# EasyEDA Pro project v02_g.eprj

# Schematic Schematic1
Create Date: 2023-01-16; Page Name: P1; Project Name: v02_g; Schematic Name: Schematic1; Update Date: 2024-06-27; Company: KC3LBR; Drawed: EasyEDA Pro; Page Size: A3; Part Number: JLCPCB-001; Reviewed: EasyEDA Pro; Version: 2023.09.11
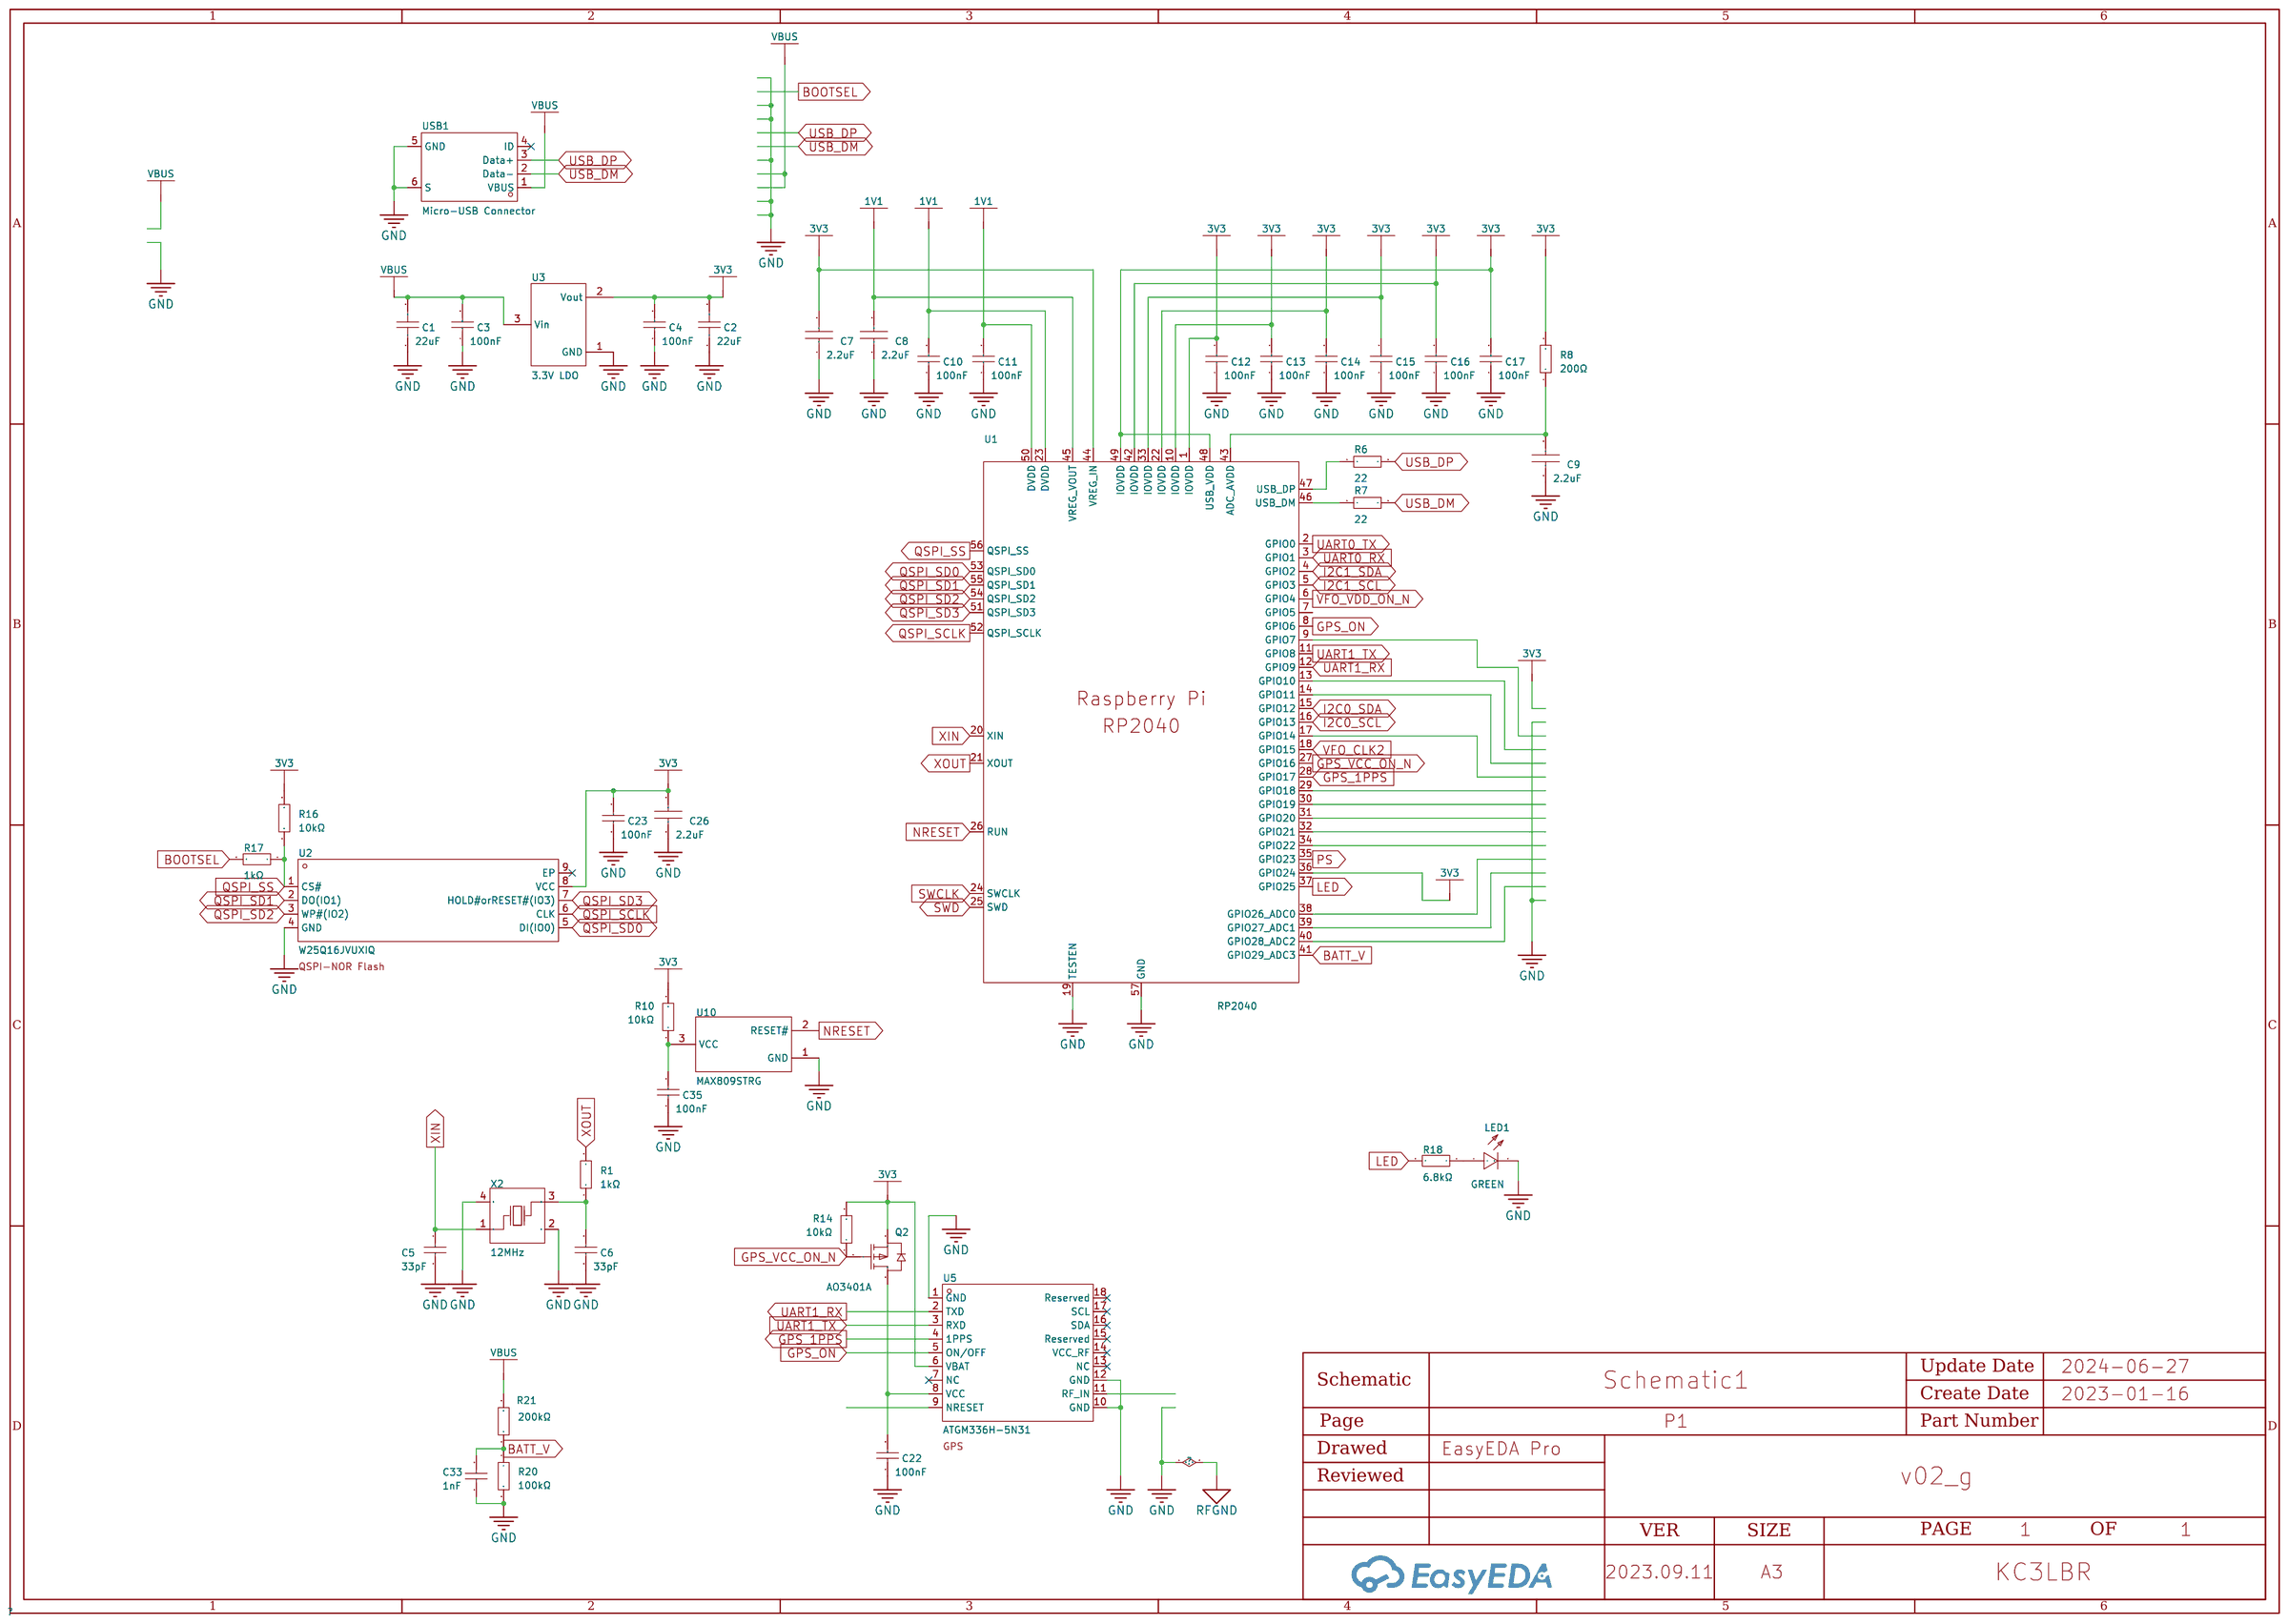
[diagram p0: schematic sheet]

## Parts
C1  22uF  [C0805]
C2  22uF  [C0603]
C3  100nF  [C0402_NEW]
C4  100nF  [C0402_NEW]
C5  33pF  [C0402]
C6  33pF  [C0402]
C7  2.2uF  [C0402]
C8  2.2uF  [C0402]
C9  2.2uF  [C0402]
C10  100nF  [C0402_NEW]
C11  100nF  [C0402_NEW]
C12  100nF  [C0402_NEW]
C13  100nF  [C0402_NEW]
C14  100nF  [C0402_NEW]
C15  100nF  [C0402_NEW]
C16  100nF  [C0402_NEW]
C17  100nF  [C0402_NEW]
C22  100nF  [C0402_NEW]
C23  100nF  [C0402_NEW]
C26  2.2uF  [C0402]
C33  1nF  [C0402]
C35  100nF  [C0402_NEW]
LED1  GREEN  [LED0603-R-RD]
Q2  AO3401A  [SOT-23_L2.9-W1.3-P1.90-LS2.4-BR]
R1  1kΩ  [R0402]
R6  22  [R0402]
R7  22  [R0402]
R8  200Ω  [R0402]
R10  10kΩ  [R0402]
R14  10kΩ  [R0402]
R16  10kΩ  [R0402]
R17  1kΩ  [R0402]
R18  6.8kΩ  [R0402]
R20  100kΩ  [R0402]
R21  200kΩ  [R0402]
U1  RP2040  [LQFN-56_L7.0-W7.0-P0.4-EP]
U2  W25Q16JVUXIQ  [USON-8_L3.0-W2.0-P0.50-BL-EP]
U3  3.3V LDO  [SOT-23-3_L2.9-W1.6-P1.90-LS2.8-BR]
U5  ATGM336H-5N31  [GPSM-SMD_ATGM336H-TR]
U10  MAX809STRG  [SOT-23-3_L2.9-W1.6-P1.90-LS2.8-BR]
USB1  Micro-USB Connector  [MICRO-USB-SMD_10118194-0001LF]
X2  12MHz  [OSC-SMD_4P-L3.2-W2.5-BL]

## Library data of the parts
C1 = CL21A226MAQNNNE_C45783: Capacitance: Tolerance:±20% Tolerance:±20% Voltage Rated: Temperature Coefficient:; LCSC Part Name: 22uF ±20% 25V; Supplier Part: C45783; Manufacturer: SAMSUNG(三星); Manufacturer Part: CL21A226MAQNNNE; Supplier Footprint: 0805; JLCPCB Part Class: Basic Part; Datasheet: https://atta.szlcsc.com/upload/public/pdf/source/20160103/1457707727161.pdf; Supplier: LCSC; Tolerance: ±20%
C2 = CL10A226MQ8NRNC: Capacitance: Tolerance:±20% Tolerance:±20% Voltage Rated: Temperature Coefficient:; LCSC Part Name: 22uF ±20% 6.3V; Supplier Part: C59461; Manufacturer: SAMSUNG(三星); Supplier Footprint: 0603; JLCPCB Part Class: Basic Part; Datasheet: https://atta.szlcsc.com/upload/public/pdf/source/20160103/1457707740762.pdf; Supplier: LCSC; Tolerance: ±20%
C3 C4 C10-C17 C22 C23 C35 = CL05B104KO5NNNC: Capacitance: Tolerance:±10% Tolerance:±10% Voltage Rated: Temperature Coefficient:; LCSC Part Name: 100nF ±10% 16V; Supplier Part: C1525; Manufacturer: SAMSUNG(三星); Supplier Footprint: 0402; JLCPCB Part Class: Basic Part; Datasheet: https://atta.szlcsc.com/upload/public/pdf/source/20160103/1457707674891.pdf; Supplier: LCSC; Tolerance: ±10%
C5 C6 = 0402CG330J500NT: Capacitance: Tolerance:±5% Tolerance:±5% Voltage Rated: Temperature Coefficient:; LCSC Part Name: 33pF ±5% 50V; Supplier Part: C1562; Manufacturer: FH(风华); Supplier Footprint: 0402; JLCPCB Part Class: Basic Part; Datasheet: https://atta.szlcsc.com/upload/public/pdf/source/20170923/C1562_1506149272462988369.pdf; Supplier: LCSC; Tolerance: ±5%
C7-C9 C26 = CL05A225MQ5NSNC: Capacitance: Tolerance:±20% Tolerance:±20% Voltage Rated: Temperature Coefficient:; LCSC Part Name: 2.2uF ±20% 6.3V; Supplier Part: C12530; Manufacturer: SAMSUNG(三星); Supplier Footprint: 0402; JLCPCB Part Class: Basic Part; Datasheet: https://atta.szlcsc.com/upload/public/pdf/source/20160103/1457707666860.pdf; Supplier: LCSC; Tolerance: ±20%
C33 = 0402B102K500NT: Capacitance: Tolerance:±10% Tolerance:±10% Voltage Rated: Temperature Coefficient:; LCSC Part Name: 1nF ±10% 50V; Supplier Part: C1523; Manufacturer: FH(风华); Supplier Footprint: 0402; JLCPCB Part Class: Basic Part; Datasheet: https://atta.szlcsc.com/upload/public/pdf/source/20170923/C1523_1506149254821988331.pdf; Supplier: LCSC; Tolerance: ±10%
LED1 = 19-217/GHC-YR1S2/3T: Emitted Color:Emerald Diode Configuration:- Lens Color:Colorless transparence Dominant Wavelength:520nm~535nm Dominant Wavelength:520nm~535nm Peak Wavelength:518nm Color Temperature:- Color Temperature:- Forward Current:20mA Power Dissipation:110mW Viewin; LCSC Part Name: 翠绿 520nm~535nm; Supplier Part: C72043; Manufacturer: EVERLIGHT(亿光); Supplier Footprint: 0603; JLCPCB Part Class: Basic Part; Datasheet: https://atta.szlcsc.com/upload/public/pdf/source/20160507/1462613613780.pdf; Supplier: LCSC; Emitted Color: Emerald; Lens Color: Colorless transparence; Dominant Wavelength: 520nm~535nm; Peak Wavelength: 518nm; Forward Current: 20mA; Power Dissipation: 110mW; Viewing Angle: 120°; Operating Temperature: -40~+85
Q2 = AO3401A_C15127: Type: Drain Source Voltage (Vdss): Continuous Drain Current (Id): Power Dissipation (Pd): Drain Source On Resistance (RDS(on)@Vgs,Id):44mΩ@10V,4.3A Gate Threshold Voltage (Vgs(th)@Id):1.3V@250uA; LCSC Part Name: P沟道 30V 4A; Supplier Part: C15127; Manufacturer: AOS; Supplier Footprint: SOT-23; JLCPCB Part Class: Basic Part; Datasheet: https://atta.szlcsc.com/upload/public/pdf/source/20160507/1462613609053.pdf; Supplier: LCSC; Drain Source On Resistance (RDS(on)@Vgs,Id): 44mΩ@10V,4.3A; Gate Threshold Voltage (Vgs(th)@Id): 1.3V@250uA
R1 R17 = 0402WGF1001TCE: Type:Thick Film Resistors Resistance: Tolerance:±1% Tolerance:±1% Power(Watts): Temperature Coefficient:±100ppm/ Temperature Coefficient:±100ppm/ Overload Voltage (Max): Operating Temperature Range:-55~+155 Operating Temperature Range:-55~+155; LCSC Part Name: 1kΩ ±1% 62.5mW; Supplier Part: C11702; Manufacturer: UNI-ROYAL(厚声); Supplier Footprint: 0402; JLCPCB Part Class: Basic Part; Datasheet: https://atta.szlcsc.com/upload/public/pdf/source/20200306/C422600_1E6D84923E4A46A82E41ADD87F860B5C.pdf; Supplier: LCSC; Type: Thick Film Resistors; Tolerance: ±1%; Temperature Coefficient: ±100ppm/; Operating Temperature Range: -55~+155
R6 R7 = 0402WGF220JTCE: LCSC Part Name: 22Ω(22R0) ±1% 编带; Supplier Part: C25092; Manufacturer: UNI-ROYAL(厚声); Supplier Footprint: 0402; JLCPCB Part Class: Basic Part; Datasheet: https://atta.szlcsc.com/upload/public/pdf/source/20170920/C25092_1505901206069982723.pdf; Supplier: LCSC
R8 = 0402WGF2000TCE: Type:Thick Film Resistors Resistance: Tolerance:±1% Tolerance:±1% Power(Watts): Temperature Coefficient:±100ppm/ Temperature Coefficient:±100ppm/ Overload Voltage (Max): Operating Temperature Range:-55~+155 Operating Temperature Range:-55~+155; LCSC Part Name: 200Ω ±1% 62.5mW; Supplier Part: C25087; Manufacturer: UNI-ROYAL(厚声); Supplier Footprint: 0402; JLCPCB Part Class: Basic Part; Datasheet: https://atta.szlcsc.com/upload/public/pdf/source/20200306/C422600_1E6D84923E4A46A82E41ADD87F860B5C.pdf; Supplier: LCSC; Type: Thick Film Resistors; Tolerance: ±1%; Temperature Coefficient: ±100ppm/; Operating Temperature Range: -55~+155
R10 R14 R16 = 0402WGF1002TCE: Type:Thick Film Resistors Resistance: Tolerance:±1% Tolerance:±1% Power(Watts): Temperature Coefficient:±100ppm/ Temperature Coefficient:±100ppm/ Overload Voltage (Max): Operating Temperature Range:-55~+155 Operating Temperature Range:-55~+155; LCSC Part Name: 10kΩ ±1% 62.5mW; Supplier Part: C25744; Manufacturer: UNI-ROYAL(厚声); Supplier Footprint: 0402; JLCPCB Part Class: Basic Part; Datasheet: https://atta.szlcsc.com/upload/public/pdf/source/20200306/C422600_1E6D84923E4A46A82E41ADD87F860B5C.pdf; Supplier: LCSC; Type: Thick Film Resistors; Tolerance: ±1%; Temperature Coefficient: ±100ppm/; Operating Temperature Range: -55~+155
R18 = 0402WGF6801TCE: Type:Thick Film Resistors Resistance: Tolerance:±1% Tolerance:±1% Power(Watts): Temperature Coefficient:±100ppm/ Temperature Coefficient:±100ppm/ Overload Voltage (Max): Operating Temperature Range:-55~+155 Operating Temperature Range:-55~+155; LCSC Part Name: 6.8kΩ ±1% 62.5mW; Supplier Part: C25917; Manufacturer: UNI-ROYAL(厚声); Supplier Footprint: 0402; JLCPCB Part Class: Basic Part; Datasheet: https://atta.szlcsc.com/upload/public/pdf/source/20200306/C422600_1E6D84923E4A46A82E41ADD87F860B5C.pdf; Supplier: LCSC; Type: Thick Film Resistors; Tolerance: ±1%; Temperature Coefficient: ±100ppm/; Operating Temperature Range: -55~+155
R20 = 0402WGF1003TCE: Type:Thick Film Resistors Resistance: Tolerance:±1% Tolerance:±1% Power(Watts): Temperature Coefficient:±100ppm/ Temperature Coefficient:±100ppm/ Overload Voltage (Max): Operating Temperature Range:-55~+155 Operating Temperature Range:-55~+155; LCSC Part Name: 100kΩ ±1% 62.5mW; Supplier Part: C25741; Manufacturer: UNI-ROYAL(厚声); Supplier Footprint: 0402; JLCPCB Part Class: Basic Part; Datasheet: https://atta.szlcsc.com/upload/public/pdf/source/20200306/C422600_1E6D84923E4A46A82E41ADD87F860B5C.pdf; Supplier: LCSC; Type: Thick Film Resistors; Tolerance: ±1%; Temperature Coefficient: ±100ppm/; Operating Temperature Range: -55~+155
R21 = 0402WGF2003TCE: Resistance: Tolerance: Power(Watts): Temperature Coefficient: Temperature Coefficient: Overload Voltage (Max): Operating Temperature Range: Operating Temperature Range:; LCSC Part Name: 200KΩ ±1%; Supplier Part: C25764; Manufacturer: UNI-ROYAL(厚声); Supplier Footprint: 0402; JLCPCB Part Class: Basic Part; Datasheet: https://atta.szlcsc.com/upload/public/pdf/source/20170920/C25764_1505901532268983339.pdf; Supplier: LCSC
U1 = RP2040_C2040: CPU Core:ARM Cortex-M0 Maximum Frequency:133MHz Supply Voltage Range:- Supply Voltage Range:- Internal Oscillator:- External Clock Frequency Rang:- External Clock Frequency Rang:- Program FLASH Size:- RAM Size:264KB EEPROM/Data FLASH Size:- GPIO Ports Num; LCSC Part Name: ARM Cortex-M0 133MHz RAM：264KB; Supplier Part: C2040; Manufacturer: Raspberry Pi(树莓派); Supplier Footprint: LQFN-56(7x7); JLCPCB Part Class: Extended Part; Datasheet: https://atta.szlcsc.com/upload/public/pdf/source/20210621/C2040_96F425825606B7957D87DD32E2512CA9.pdf; Supplier: LCSC; CPU Core: ARM Cortex-M0; Maximum Frequency: 133MHz; RAM Size: 264KB; GPIO Ports Number: 30; ADC (Units/Channels/bits): 1@x4ch/12bit; U(S)ART Number: 2; I2C Number: 2; (Q)SPI Number: 2; USB (H/D/OTG): USB Host/Device; Peripherals / Functions / Protocol Stacks: DMA；PWM
U2 = W25Q16JVUXIQ: QSPI-NOR Flash; Supplier Part: C2843335; Manufacturer: WINBOND(华邦); Supplier Footprint: USON-8; JLCPCB Part Class: Extended Part; Datasheet: https://atta.szlcsc.com/upload/public/pdf/source/20210629/C2843335_FB4D78B5076715625DC0C83F790D3044.pdf; Supplier: LCSC
U3 = XC6206P332MR_C5446: Output Type: Output Polarity:Positive Number of Outputs:1 Maximum Input Voltage:6V Output Voltage:3.3V~3.3V Output Voltage:3.3V~3.3V Dropout Voltage:680mV@(100mA) Output Current:200mA Power Supply Rejection Ratio (PSRR):-; LCSC Part Name: 正 Vin=6V Vout=3.3V 200mA; Supplier Part: C5446; Manufacturer: TOREX(特瑞仕); Manufacturer Part: XC6206P332MR; Supplier Footprint: SOT-23; JLCPCB Part Class: Basic Part; Datasheet: https://atta.szlcsc.com/upload/public/pdf/source/20130801/1457706628791.pdf; Supplier: LCSC; Output Polarity: Positive; Number of Outputs: 1; Maximum Input Voltage: 6V; Output Voltage: 3.3V~3.3V; Dropout Voltage: 680mV@(100mA); Output Current: 200mA
U5 = ATGM336H-5N31: GPS; Supplier Part: C90770; Manufacturer: 杭州中科微; Supplier Footprint: 9.7x10.1mm; JLCPCB Part Class: Extended Part; Datasheet: https://atta.szlcsc.com/upload/public/pdf/source/20161226/1482720799860.pdf; Supplier: LCSC
U10 = MAX809STRG: Output Type:推挽 Reset Active Level:低电平有效 Number of Voltages Monitored:1 Threshold Voltage:2.93V Reset Timeout:140ms Operating Temperature:-40~+105@(TJ) Operating Temperature:-40~+105@(TJ) Type of the Power Management Chip:Simple reset/Power-on reset; LCSC Part Name: Voltage Supervisor, Very Low Supply Current, 3-Pin Microprocessor, Reset Monitor; Supplier Part: C9965; Manufacturer: onsemi(安森美); Supplier Footprint: SOT-23; JLCPCB Part Class: Extended Part; Datasheet: https://atta.szlcsc.com/upload/public/pdf/source/20170918/C9965_1505727085373976535.PDF; Supplier: LCSC; Output Type: 推挽; Reset Active Level: 低电平有效; Number of Voltages Monitored: 1; Threshold Voltage: 2.93V; Reset Timeout: 140ms; Operating Temperature: -40~+105@(TJ); Type of the Power Management Chip: Simple reset/Power-on reset
USB1 = 10118194-0001LF: Connector Type:Micro-B Standard:USB 2.0 Gender:Female Number of Contacts:5 Number of Ports:1; LCSC Part Name: Micro-B 母座; Supplier Part: C132563; Manufacturer: Amphenol; Supplier Footprint: SMD; JLCPCB Part Class: Extended Part; Datasheet: https://atta.szlcsc.com/upload/public/pdf/source/20210630/C132563_323781699BE9D7BFAD8DF70EA5820798.pdf; Supplier: LCSC; Connector Type: Micro-B; Standard: USB 2.0; Gender: Female; Number of Contacts: 5; Number of Ports: 1
X2 = X322512MSB4SI: Crystal Type:SMD Crystal Resonator Frequency: Frequency Tolerance:±10ppm Frequency Tolerance:±10ppm Frequency Stability:±30ppm Frequency Stability:±30ppm Load Capacitance: Operating Temperature: Operating Temperature:; LCSC Part Name: 12MHz ±10ppm 20pF; Supplier Part: C9002; Manufacturer: YXC(扬兴晶振); Supplier Footprint: SMD3225-4P; JLCPCB Part Class: Basic Part; Datasheet: https://atta.szlcsc.com/upload/public/pdf/source/20210329/C112971_1F611BDC486E193C1706F6D8EB5AA189.pdf; Supplier: LCSC; Crystal Type: SMD Crystal Resonator; Frequency Tolerance: ±10ppm; Frequency Stability: ±30ppm

## Nets
1V1: C8.2 C10.2 C11.2 U1.23(DVDD) U1.45(VREG_VOUT) U1.50(DVDD)
3V3: C2.2 C4.2 C7.2 C12.2 C13.2 C14.2 C15.2 C16.2 C17.2 C23.2 C26.2 Q2.2(S) R8.2 R10.2 R14.2 R16.2 U1.1(IOVDD) U1.10(IOVDD) U1.22(IOVDD) U1.33(IOVDD) U1.36(GPIO24) U1.42(IOVDD) U1.44(VREG_IN) U1.48(USB_VDD) U1.49(IOVDD) U2.8(VCC) U3.2(Vout) U5.6(VBAT)
GND: C1.1 C2.1 C3.1 C4.1 C5.1 C6.1 C7.1 C8.1 C9.1 C10.1 C11.1 C12.1 C13.1 C14.1 C15.1 C16.1 C17.1 C22.1 C23.1 C26.1 C33.1 C35.1 LED1.2(C) R20.2 U1.19(TESTEN) U1.57(GND) U2.4(GND) U3.1(GND) U5.1(GND) U5.10(GND) U5.12(GND) U10.1(GND) USB1.5(GND) USB1.6(S) X2.2(GND) X2.4(GND)
VBUS: C1.2 C3.2 R21.2 U3.3(Vin) USB1.1(VBUS)
ADC0: U1.38(GPIO26_ADC0)
ADC1: U1.39(GPIO27_ADC1)
ADC2: U1.40(GPIO28_ADC2)
ADC_AVDD: C9.2 R8.1 U1.43(ADC_AVDD)
BATT_V: C33.2 R20.1 R21.1 U1.41(GPIO29_ADC3)
BOOTSEL: R17.2
GPIO7: U1.9(GPIO7)
GPIO10: U1.13(GPIO10)
GPIO11: U1.14(GPIO11)
GPIO14: U1.17(GPIO14)
GPIO18: U1.29(GPIO18)
GPIO19: U1.30(GPIO19)
GPIO20: U1.31(GPIO20)
GPIO21: U1.32(GPIO21)
GPIO22: U1.34(GPIO22)
GPS_1PPS: U1.28(GPIO17) U5.4(1PPS)
GPS_3V3: C22.2 Q2.3(D) U5.8(VCC)
GPS_ANT: U5.11(RF_IN)
GPS_ON: U1.8(GPIO6) U5.5(ON/OFF)
GPS_VCC_ON_N: Q2.1(G) R14.1 U1.27(GPIO16)
I2C0_SCL: U1.16(GPIO13)
I2C0_SDA: U1.15(GPIO12)
I2C1_SCL: U1.5(GPIO3)
I2C1_SDA: U1.4(GPIO2)
LED: R18.2 U1.37(GPIO25)
NRESET: U1.26(RUN) U10.2(RESET#)
PS: U1.35(GPIO23)
QSPI_SCLK: U1.52(QSPI_SCLK) U2.6(CLK)
QSPI_SD0: U1.53(QSPI_SD0) U2.5(DI(IO0))
QSPI_SD1: U1.55(QSPI_SD1) U2.2(DO(IO1))
QSPI_SD2: U1.54(QSPI_SD2) U2.3(WP#(IO2))
QSPI_SD3: U1.51(QSPI_SD3) U2.7(HOLD#orRESET#(IO3))
QSPI_SS: R16.1 R17.1 U1.56(QSPI_SS) U2.1(CS#)
SWCLK: U1.24(SWCLK)
SWD: U1.25(SWD)
UART0_RX: U1.3(GPIO1)
UART0_TX: U1.2(GPIO0)
UART1_RX: U1.12(GPIO9) U5.2(TXD)
UART1_TX: U1.11(GPIO8) U5.3(RXD)
USB_DM: R7.2 USB1.2(Data-)
USB_DP: R6.2 USB1.3(Data+)
VFO_CLK2: U1.18(GPIO15)
VFO_VDD_ON_N: U1.6(GPIO4)
XIN: C5.2 U1.20(XIN) X2.1(OSC1)
XOUT: R1.2 U1.21(XOUT)
$1N22007: R7.1 U1.46(USB_DM)
$1N22362: R6.1 U1.47(USB_DP)
$1N70752: C6.2 R1.1 X2.3(OSC2)
$1N107124: LED1.1(A) R18.1
$1N115739: C35.2 R10.1 U10.3(VCC)

Not connected (* = marked no-connect by the designer): U1 7(GPIO5); U2 9(EP)*; U5 7(NC)* 9(NRESET) 13(NC)* 14(VCC_RF)* 15(Reserved)* 16(SDA)* 17(SCL)* 18(Reserved)*; USB1 4(ID)*

# Board PCB1
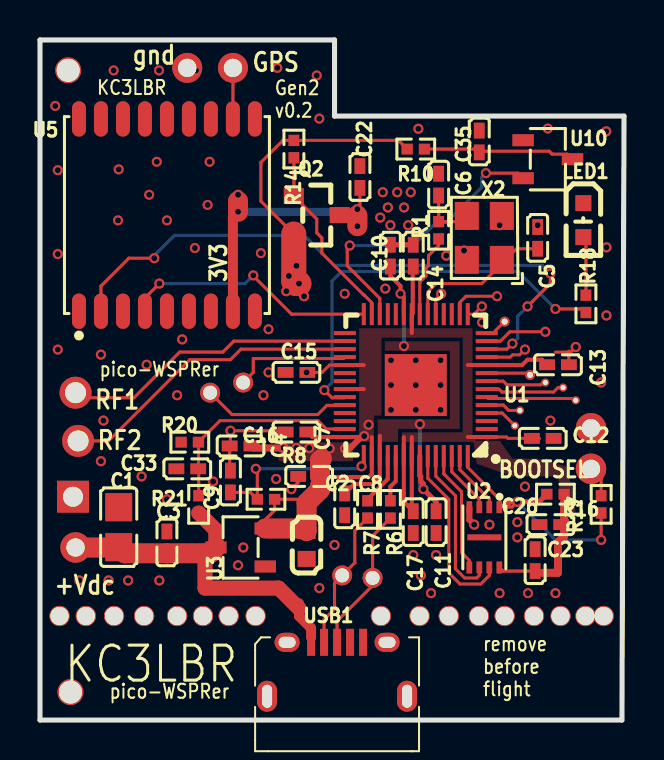
[diagram p1: board, top side]
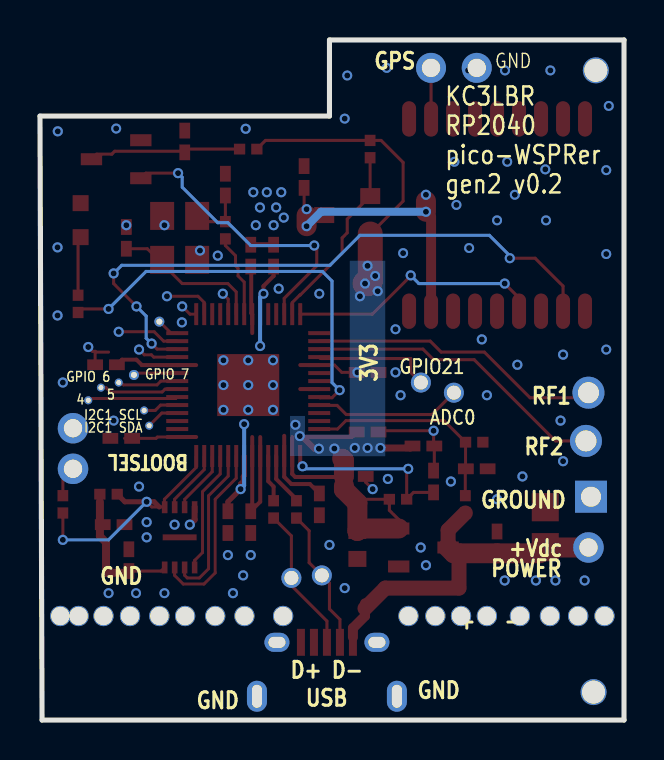
[diagram p2: board, bottom side, seen from below]

Outline 29.21 x 34.04 mm; copper layers: Top Layer, Bottom Layer. Coordinates in mm from the lower left corner of the outline.
Outline path: 0,34.04 0,0 29.11,0 29.21,30.23 14.73,30.23 14.73,34.04 0,34.04
Stack: Top Layer 0.035mm / Dielectric1 1.51mm FR4 er 4.5 / Bottom Layer 0.035mm

## Design rules (mm)
spacing safeClearance (default): track to track 0.152, other pairs 0.152 to 0.3
track width trackWidth (default): min 0.127, default 0.254, max 2.54
differential pair differentialPair (default): width min 0.127, default 0.254, max 2.54; gap min 0.152, default 0.152
via viaSize (default): diameter min 0.5, default 0.61, max 10; hole min 0.3, default 0.305, max 6

## Placement (name value [footprint] x y rotation side)
C1  22uF  [C0805]  3.94 9.65 270 top
C2  22uF  [C0603]  13.34 8.76 90 top
C3  100nF  [C0402_NEW]  6.35 8.89 270 top
C4  100nF  [C0402_NEW]  10.03 13.72 0 top
C5  33pF  [C0402]  24.89 24.13 270 top
C6  33pF  [C0402]  19.94 26.8 270 top
C7  2.2uF  [C0402]  13.46 12.19 0 top
C8  2.2uF  [C0402]  15.24 10.79 90 top
C9  2.2uF  [C0402]  9.53 11.94 270 top
C10  100nF  [C0402_NEW]  17.53 23.24 270 top
C11  100nF  [C0402_NEW]  19.81 9.91 90 top
C12  100nF  [C0402_NEW]  25.15 14.1 180 top
C13  100nF  [C0402_NEW]  25.91 17.78 180 top
C14  100nF  [C0402_NEW]  18.67 23.24 270 top
C15  100nF  [C0402_NEW]  12.83 17.4 0 top
C16  100nF  [C0402_NEW]  12.83 14.41 0 top
C17  100nF  [C0402_NEW]  18.67 9.91 90 top
C22  100nF  [C0402_NEW]  16 27.18 270 top
C23  100nF  [C0402_NEW]  24.76 8 270 top
C26  2.2uF  [C0402]  25.53 9.78 0 top
C33  1nF  [C0402]  7.37 12.57 0 top
C35  100nF  [C0402_NEW]  21.97 28.96 270 top
LED1  GREEN  [LED0603-R-RD]  27.18 25.02 270 top
NOREF  -  [Pad_e1306]  5.21 5.21 0 top
NOREF#2  -  [Pad_e33]  1.91 13.97 0 top
NOREF#3  -  [Pad_e1309]  0.98 5.21 0 top
NOREF#4  -  [Pad_e2702]  23.24 19.94 0 top
NOREF#5  -  [Pad_e1296]  18.99 5.21 0 top
NOREF#6  -  [Pad_e1300]  23.24 5.21 0 top
NOREF#7  -  [Pad_e35]  1.78 16.38 0 top
NOREF#8  -  [Pad_e4113]  10.16 16.89 0 top
NOREF#9  -  [Pad_e2374]  26.8 16 0 top
NOREF#10  -  [Pad_e72]  1.78 8.64 0 top
NOREF#11  -  [Pad_e1299]  26.03 5.21 0 top
NOREF#12  -  [Pad_e854]  6.86 5.21 0 top
NOREF#13  -  [Pad_e2375]  26.16 16.64 0 top
NOREF#14  -  [Pad_e5590]  1.52 1.4 0 top
NOREF#15  -  [Pad_e1295]  10.78 5.21 0 top
NOREF#16  -  [Pad_e1307]  3.71 5.21 0 top
NOREF#17  -  [Pad_e1297]  20.45 5.21 0 top
NOREF#18  -  [Pad_e19]  1.65 11.18 0 top
NOREF#19  -  [Pad_e1696]  23.75 14.73 0 top
NOREF#20  -  [Pad_e1301]  24.71 5.21 0 top
NOREF#21  -  [Pad_e54]  27.56 12.57 0 top
NOREF#22  -  [Pad_e3084]  17.05 5.21 0 top
NOREF#23  -  [Pad_e1298]  21.95 5.21 0 top
NOREF#24  -  [Pad_e1294]  9.44 5.21 0 top
NOREF#25  -  [Pad_e2607]  28.19 5.21 0 top
NOREF#26  -  [Pad_e3799]  27.56 14.6 0 top
NOREF#27  -  [Pad_e2705]  25.27 16.89 0 top
NOREF#28  -  [Pad_e1012]  7.37 32.64 0 top
NOREF#29  -  [Pad_e1293]  8.15 5.21 0 top
NOREF#30  -  [Pad_e1308]  2.29 5.21 0 top
NOREF#31  -  [Pad_e66]  16.64 7.11 0 top
NOREF#32  -  [Pad_e1303]  27.28 5.21 0 top
NOREF#33  -  [Pad_e2706]  24.51 17.27 0 top
NOREF#34  -  [Pad_e5896]  1.41 32.52 0 top
NOREF#35  -  [Pad_e568]  9.65 32.64 0 top
NOREF#36  -  [Pad_e4114]  8.51 16.38 0 top
NOREF#37  -  [Pad_e2975]  15.11 7.24 0 top
NOREF#38  -  [Pad_e1695]  24 15.49 0 top
Q2  AO3401A  [SOT-23_L2.9-W1.3-P1.90-LS2.4-BR]  13.84 25.27 180 top
R1  1kΩ  [R0402]  19.94 24.51 270 top
R6  22  [R0402]  17.53 10.54 270 top
R7  22  [R0402]  16.38 10.54 270 top
R8  200Ω  [R0402]  11.3 11.05 0 top
R10  10kΩ  [R0402]  18.8 28.57 180 top
R14  10kΩ  [R0402]  12.7 28.57 90 top
R16  10kΩ  [R0402]  25.78 11.3 0 top
R17  1kΩ  [R0402]  28.07 10.79 90 top
R18  6.8kΩ  [R0402]  27.31 20.83 270 top
R20  100kΩ  [R0402]  7.49 13.91 180 top
R21  200kΩ  [R0402]  7.94 10.79 270 top
U1  RP2040  [LQFN-56_L7.0-W7.0-P0.4-EP]  18.8 16.76 180 top
U2  W25Q16JVUXIQ  [USON-8_L3.0-W2.0-P0.50-BL-EP]  22.22 9.14 180 top
U3  3.3V LDO  [SOT-23-3_L2.9-W1.6-P1.90-LS2.8-BR]  10.03 8.64 0 top
U5  ATGM336H-5N31  [GPSM-SMD_ATGM336H-TR]  6.35 25.27 180 top
U10  MAX809STRG  [SOT-23-3_L2.9-W1.6-P1.90-LS2.8-BR]  25.4 28.07 180 top
USB1  Micro-USB Connector  [MICRO-USB-SMD_10118194-0001LF]  14.86 2.54 0 top
X2  12MHz  [OSC-SMD_4P-L3.2-W2.5-BL]  22.22 24.13 90 top

## Footprints (pads in the part's own frame, mm; a bottom-side part is the same pattern mirrored in y, then rotated)
C0402
  rect 0.79x0.54 smd: 1(-0.545,0) 2(0.545,0)
C0402_NEW
  rect 0.79x0.54 smd: 1(-0.545,0) 2(0.545,0)
C0603
  rect 0.8x0.9 smd: 1(-0.7,0) 2(0.7,0)
C0805
  rect 1.41x1.35 smd: 1(-1,0) 2(1,0)
GPSM-SMD_ATGM336H-TR
  oval 0.7x1.773 smd: 1(4.4,4.811) 2(3.3,4.811) 3(2.2,4.811) 4(1.1,4.811) 5(0,4.811) 6(-1.1,4.811) 7(-2.2,4.811) 8(-3.3,4.811) 9(-4.4,4.811) 10(-4.4,-4.811) 11(-3.3,-4.811) 12(-2.2,-4.811) 13(-1.1,-4.811) 14(0,-4.811) 15(1.1,-4.811) 16(2.2,-4.811) 17(3.3,-4.811) 18(4.4,-4.811)
LED0603-R-RD
  rect 0.8x0.8 smd: 1(0.851,0) 2(-0.851,0)
LQFN-56_L7.0-W7.0-P0.4-EP
  rect 1.1x0.2 smd: 1(-3.55,2.6) 2(-3.55,2.2) 3(-3.55,1.8) 4(-3.55,1.4) 5(-3.55,1) 6(-3.55,0.6) 7(-3.55,0.2) 8(-3.55,-0.2) 9(-3.55,-0.6) 10(-3.55,-1) 11(-3.55,-1.4) 12(-3.55,-1.8) 13(-3.55,-2.2) 14(-3.55,-2.6) 29(3.55,-2.6) 30(3.55,-2.2) 31(3.55,-1.8) 32(3.55,-1.4) 33(3.55,-1) 34(3.55,-0.6) 35(3.55,-0.2) 36(3.55,0.2) 37(3.55,0.6) 38(3.55,1) 39(3.55,1.4) 40(3.55,1.8) 41(3.55,2.2) 42(3.55,2.6)
  rect 0.2x1.1 smd: 15(-2.6,-3.55) 16(-2.2,-3.55) 17(-1.8,-3.55) 18(-1.4,-3.55) 19(-1,-3.55) 20(-0.6,-3.55) 21(-0.2,-3.55) 22(0.2,-3.55) 23(0.6,-3.55) 24(1,-3.55) 25(1.4,-3.55) 26(1.8,-3.55) 27(2.2,-3.55) 28(2.6,-3.55) 43(2.6,3.55) 44(2.2,3.55) 45(1.8,3.55) 46(1.4,3.55) 47(1,3.55) 48(0.6,3.55) 49(0.2,3.55) 50(-0.2,3.55) 51(-0.6,3.55) 52(-1,3.55) 53(-1.4,3.55) 54(-1.8,3.55) 55(-2.2,3.55) 56(-2.6,3.55)
  rect 3.1x3.1 smd: 57(0,0)
MICRO-USB-SMD_10118194-0001LF
  rect 0.4x1.35 smd: 1(-1.3,1.35) 2(-0.65,1.35) 3(0,1.35) 4(0.65,1.35) 5(1.3,1.35)
  oval 1x1.55 hole 0.5x1.15: 6(-3.5,-1.35) 6(3.5,-1.35)
  oval 1.25x0.95 hole 0.85x0.55: 6(-2.5,1.35) 6(2.5,1.35)
OSC-SMD_4P-L3.2-W2.5-BL
  rect 1.4x1.2 smd: 1(-1.1,-0.875) 2(1.1,-0.875) 3(1.1,0.875) 4(-1.1,0.875)
Pad_e19
  rect 1.6x1.6 hole 1: 7(0,0)
Pad_e33
  round 1.6 hole 1.05: 14(0,0)
Pad_e35
  round 1.6 hole 1.05: 15(0,0)
Pad_e54
  round 1.524 hole 0.914: 17(0,0)
Pad_e66
  round 1 hole 0.7: 75(0,0)
Pad_e72
  round 1.524 hole 0.914: 98(0,0)
Pad_e568
  round 1.5 hole 0.914: 4(0,0)
Pad_e854
  round 1.016 hole 0.914: 0(0,0)
Pad_e1012
  round 1.5 hole 0.914: 9(0,0)
Pad_e1293
  round 1.016 hole 0.914: 1(0,0)
Pad_e1294
  round 1.016 hole 0.914: 2(0,0)
Pad_e1295
  round 1.016 hole 0.914: 3(0,0)
Pad_e1296
  round 1.016 hole 0.914: 4(0,0)
Pad_e1297
  round 1.016 hole 0.914: 5(0,0)
Pad_e1298
  round 1.016 hole 0.914: 6(0,0)
Pad_e1299
  round 1.016 hole 0.914: 7(0,0)
Pad_e1300
  round 1.016 hole 0.914: 14(0,0)
Pad_e1301
  round 1.016 hole 0.914: 23(0,0)
Pad_e1303
  round 1.016 hole 0.914: 25(0,0)
Pad_e1306
  round 1.016 hole 0.914: 14(0,0)
Pad_e1307
  round 1.016 hole 0.914: 15(0,0)
Pad_e1308
  round 1.016 hole 0.914: 16(0,0)
Pad_e1309
  round 1.016 hole 0.914: 17(0,0)
Pad_e1695
  round 0.4 hole 0.25: 41(0,0)
Pad_e1696
  round 0.4 hole 0.25: 57(0,0)
Pad_e2374
  round 0.4 hole 0.25: 47(0,0)
Pad_e2375
  round 0.4 hole 0.25: 48(0,0)
Pad_e2607
  round 1.016 hole 0.914: 49(0,0)
Pad_e2702
  round 0.5 hole 0.3: 21(0,0)
Pad_e2705
  round 0.4 hole 0.25: 26(0,0)
Pad_e2706
  round 0.5 hole 0.3: 27(0,0)
Pad_e2975
  round 1 hole 0.7: 79(0,0)
Pad_e3084
  round 1.016 hole 0.914: 29(0,0)
Pad_e3799
  round 1.524 hole 0.914: 106(0,0)
Pad_e4113
  round 1 hole 0.7: 98(0,0)
Pad_e4114
  round 1 hole 0.7: 118(0,0)
Pad_e5590
  round 1.3 hole 1.152: 3(0,0)
Pad_e5896
  round 1.3 hole 1.152: 1(0,0)
R0402
  rect 0.566x0.54 smd: 1(-0.433,0) 2(0.433,0)
SOT-23-3_L2.9-W1.6-P1.90-LS2.8-BR
  rect 1.07x0.6 smd: 1(1.235,-0.95) 2(1.235,0.95) 3(-1.235,0)
SOT-23_L2.9-W1.3-P1.90-LS2.4-BR
  rect 1x0.8 smd: 1(1.15,-0.95) 2(1.15,0.95) 3(-1.15,0)
USON-8_L3.0-W2.0-P0.50-BL-EP
  rect 0.28x0.6 smd: 1(-0.75,-1.508) 2(-0.25,-1.508) 3(0.25,-1.508) 4(0.75,-1.508) 5(0.75,1.508) 6(0.25,1.508) 7(-0.25,1.508) 8(-0.75,1.508)
  rect 1.7x0.3 smd: 9(0,0)

## Nets
1V1: C8.2 C10.2 C11.2 U1.23 U1.45 U1.50
3V3: C2.2 C4.2 C7.2 C12.2 C13.2 C14.2 C15.2 C16.2 C17.2 C23.2 C26.2 Q2.2 R8.2 R10.2 R14.2 R16.2 U1.1 U1.10 U1.22 U1.33 U1.36 U1.42 U1.44 U1.48 U1.49 U2.8 U3.2
GND: C1.1 C2.1 C3.1 C4.1 C5.1 C6.1 C7.1 C8.1 C9.1 C10.1 C11.1 C12.1 C13.1 C14.1 C15.1 C16.1 C17.1 C22.1 C23.1 C26.1 C33.1 C35.1 LED1.2 NOREF#18.7 NOREF#26.106 NOREF#28.9 R20.2 U1.19 U1.57 U2.4 U3.1 U5.1 U5.10 U5.12 U10.1 USB1.5 USB1.6 X2.2 X2.4
VBUS: C1.2 C3.2 NOREF#10.98 R21.2 U3.3 USB1.1
ADC0: NOREF#36.118 U1.38
ADC1: U1.39
ADC2: U1.40
ADC_AVDD: C9.2 R8.1 U1.43
BATT_V: C33.2 R20.1 R21.1 U1.41
BOOTSEL: NOREF#21.17 R17.2
GPIO7: NOREF#33.27 U1.9
GPIO10: U1.13
GPIO11: NOREF#4.21 U1.14
GPIO14: U1.17
GPIO18: U1.29
GPIO19: NOREF#7.15 U1.30
GPIO20: NOREF#2.14 U1.31
GPIO21: NOREF#8.98 U1.32
GPIO22: U1.34
GPS_1PPS: U1.28 U5.4
GPS_3V3: C22.2 Q2.3 U5.8
GPS_ANT: NOREF#35.4 U5.11
GPS_ON: NOREF#27.26 U1.8
GPS_VCC_ON_N: Q2.1 R14.1 U1.27
I2C0_SCL: U1.16
I2C0_SDA: U1.15
I2C1_SCL: NOREF#38.41 U1.5
I2C1_SDA: NOREF#19.57 U1.4
LED: R18.2 U1.37
NRESET: U1.26 U10.2
PS: U1.35
QSPI_SCLK: U1.52 U2.6
QSPI_SD0: U1.53 U2.5
QSPI_SD1: U1.55 U2.2
QSPI_SD2: U1.54 U2.3
QSPI_SD3: U1.51 U2.7
QSPI_SS: R16.1 R17.1 U1.56 U2.1
SWCLK: U1.24
SWD: U1.25
UART0_RX: U1.3
UART0_TX: U1.2
UART1_RX: U1.12 U5.2
UART1_TX: U1.11
USB_DM: NOREF#37.79 R7.2 USB1.2
USB_DP: NOREF#31.75 R6.2 USB1.3
VFO_CLK2: U1.18
VFO_VDD_ON_N: NOREF#9.47 U1.6
XIN: C5.2 U1.20 X2.1
XOUT: R1.2 U1.21
$1N14334: U5.9
$1N22007: R7.1 U1.46
$1N22362: R6.1 U1.47
$1N70752: C6.2 R1.1 X2.3
$1N107124: LED1.1 R18.1
$1N115739: C35.2 R10.1 U10.3

Pads without a net: NOREF 14; NOREF#3 17; NOREF#5 4; NOREF#6 14; NOREF#11 7; NOREF#12 0; NOREF#13 48; NOREF#14 3; NOREF#15 3; NOREF#16 15; NOREF#17 5; NOREF#20 23; NOREF#22 29; NOREF#23 6; NOREF#24 2; NOREF#25 49; NOREF#29 1; NOREF#30 16; NOREF#32 25; NOREF#34 1; U1 7; U2 9; U5 3 5 6 7 13 14 15 16 17 18; USB1 4

## Via types
v1: diameter 0.508, hole 0.3, Top Layer to Bottom Layer, 99 vias
v2: diameter 0.5, hole 0.3, Top Layer to Bottom Layer, 27 vias

## Routing (per net, layer and track width the routed paths; a pad name or vN(x,y) marks a point on that pad's centre or on a via; arc(x,y) is an arc through that point)
1V1: length 15.8
  Top Layer w0.2: 17.53,22.68 17.53,22.22 18.03,21.72 v2(18.03,21.34) 18.2,21.17 U1.23 ; 17,14.22 U1.45 17,12.17 16.64,11.81 15.71,11.81 C8.2
  Top Layer w0.254: C11.2 19.81,10.92 v1(19.18,11.56) 19.18,11.82 19.04,11.95 19.04,12.19 19,12.23 U1.50
  Bottom Layer w0.2: v2(18.03,21.34) 18.2,21.17 v1(18.2,18.72) ; 19.13,11.61 19,11.73 v1(19,14.81)
3V3: length 63.2
  Top Layer w0.15: v1(13.34,17.4) 13.32,17.4 13.34,17.38 13.35,17.4 ; 24.98,14.1 23.41,14.1 23.34,14.16 22.35,14.16 ; U1.33 14.48,17.76 14.11,17.4 C15.2
  Top Layer w0.154: v1(13.34,17.4) C15.2 ; U2.8 23.16,7.46 C23.2 ; 13.34,11.05 R8.2 11.74,10.5 11.27,10.03 U3.2 ; R10.2 17.93,29.01 R14.2 12.15,29.01 11.05,27.91 11.05,25.97 Q2.2 ; 14.01,11.72 14.01,12.19
  Top Layer w0.2: 18.6,19.37 U1.22 18.64,20.36 18.64,22.67 C14.2 18.67,22.82 ; C13.2 25.11,18.03 24.38,18.03 24.11,17.76 U1.10 21.4,17.76 ; 22.35,14.16 21.4,14.16 ; 18.6,10.52 18.2,10.92 U1.48 18.2,14.16 ; 18.6,10.52 U1.49 18.6,14.16 ; 18.6,10.52 C17.2 ; 14.41,12.16 16.45,12.16 16.6,12.31 U1.44 16.6,14.16 ; U1.36 16.19,16.56 ; U1.33 16.19,17.76 ; C16.2 13.62,14.16 16.17,14.16 ; 16.17,14.16 v1(16.22,14.21) ; 16.17,14.16 16.22,14.16
  Top Layer w0.3: v1(15.26,13.58) 15.49,13.58 16.07,14.16
  Top Layer w0.35: C4.2 10.68,13.62 v1(12.19,13.62)
  Top Layer w0.4: 26.21,10.92 26.21,9.2 25.91,8.89 25.91,7.37 25.11,7.37
  Top Layer w1: 14.1,13.08 14.01,12.99 14.01,12.19 ; U3.2 13.21,9.59 C2.2 13.34,10.86 14.01,11.53 14.01,11.72
  Top Layer w1.25: v1(12.95,21.84) 12.81,21.84 12.69,21.96 Q2.2
  vias: v1(12.32,21.46) v1(12.45,22.22) v1(12.83,22.73) v1(12.83,13.62) v1(13.21,21.21) v1(13.47,13.62) v1(14.49,13.59) v1(16.43,14.78)
GND: length 10.8
  Top Layer w0.15: 26.45,18.45 26.58,18.45 v1(26.8,18.67) ; 26.45,18.45 26.42,18.41 25.78,18.41 ; 26.45,18.45 C13.1 ; U1.19 19.8,21.07 v1(20.07,21.34)
  Top Layer w0.154: C7.1 12.92,11.9 v1(12.57,11.56) ; 9.49,12.32 C4.1 9.53,13.75 v1(9.53,14.48) 12.22,14.48 C16.1
  Top Layer w0.254: C10.1 C14.1
  Top Layer w0.3: v1(21.72,9.78) 21.47,10.02 U2.4
  vias: v1(1.97,6.98) v1(3.05,18.29) v1(3.05,12.95) v1(3.18,14.99) v1(3.43,6.98) v1(4.41,6.98) v1(5.08,12.19) v1(5.33,17.78) v1(5.97,6.98) v1(6.35,11.05) v1(6.86,16.26) v1(7.11,19.05) v1(8.66,11.94) v1(9.91,7.75) v1(10.17,8.64) v1(11.18,16.26) v1(11.43,17.4) v1(11.81,12.06) v1(13.97,6.6) v1(14.73,8.76) v1(17.02,25.15) v1(17.15,26.42) v1(17.27,21.59) v1(17.4,25.65) v1(17.53,24.76) v1(17.56,18) v1(17.56,16.76) v1(17.56,15.52) v1(17.87,26.42) v1(18.21,25.65) v1(18.41,24.76) v1(18.54,26.42) v1(18.67,8.25) v1(18.8,18) v1(18.8,16.76) v1(18.8,15.52) v1(18.92,29.59) v1(19.05,7.24) v1(19.56,6.35) v1(19.81,8.25) v1(20.04,18) v1(20.04,16.76) v1(20.04,15.52) v1(20.32,23.24) v1(21.21,23.49) v1(22.11,19.9) v1(22.48,9.78) v1(22.99,24.76) v1(23.88,9.91) v1(23.88,9.14) v1(24.26,11.68) v1(24.89,24.76) v1(28.07,16.89) v1(28.32,29.46) v1(28.33,23.66) v1(28.33,20.25) v2(0.76,30.73) v2(0.89,27.52) v2(0.89,23.32) v2(0.89,18.54) v2(3.68,32.51) v2(3.94,27.56) v2(3.9,25.01) v2(5.46,26.29) v2(5.84,27.94) v2(5.95,32.51) v2(6.35,25.01) v2(7.75,23.62) v2(7.8,32.51) v2(8.38,25.78) v2(8.48,27.94) v2(11.05,23.37) v2(11.43,19.56) v2(11.87,32.64) v2(13.84,32.26) v2(13.97,30.1) v2(15.24,21.34) v2(22.99,6.35) v2(24.41,6.35) v2(25.4,29.6) v2(25.53,14.99) v2(25.78,6.35)
VBUS: length 18.2
  Top Layer w0.5: 13.56,4.14 13.56,4.6 12.95,5.21 12.95,5.84
  Top Layer w0.75: 8.25,8.34 8.25,6.6 11.94,6.6 12.95,5.59 ; U3.3 8.8,9.5 7.94,10.36
  Top Layer w1: NOREF#10.98 3.92,8.64 C1.2 4.24,8.34 C3.2 8.51,8.34 U3.3
(no net): length 4
  Top Layer w0.15: NOREF#13.48 25.91,16.64 25.69,16.41 23.1,16.41 22.95,16.56 U1.7
ADC0: length 7.4
  Top Layer w0.154: NOREF#36.118 9.6,15.29 13.89,15.29 14.35,15.75 15.23,15.75 U1.38
ADC_AVDD: length 8.4
  Top Layer w0.154: C9.2 10.53,11.39 R8.1 10.87,12.5 v1(10.79,12.57)
  Bottom Layer w0.154: v1(16.08,12.7) 15.96,12.57 v1(10.79,12.57)
BATT_V: length 10.6
  Top Layer w0.15: R21.1 7.94,12.55 C33.2 7.93,12.59 R20.1 9.01,14.99 13.91,14.99 14.33,14.56 U1.41
BOOTSEL: length 1.7
  Top Layer w0.154: 27.56,12.7 28.07,12.19 R17.2
GPIO7: length 2.2
  Top Layer w0.15: U1.9 24.42,17.36 NOREF#33.27
GPIO10: length 3.1
  Top Layer w0.15: U1.13 23.03,18.96 23.5,19.43 v1(25.27,19.43)
GPIO11: length 1.2
  Top Layer w0.15: 23.25,19.96 22.66,19.36 U1.14
GPIO19: length 15.2
  Top Layer w0.154: 1.27,16.13 4.7,16.13 6.99,18.41 9.14,18.41 9.69,18.96 U1.30
GPIO20: length 15.8
  Top Layer w0.154: 1.4,13.84 1.52,13.97 3.43,13.97 7.49,18.03 9.53,18.03 10.06,18.56 U1.31
GPIO21: length 6
  Top Layer w0.154: 15.25,18.16 15.18,18.09 10.67,18.09 10.67,17.4 NOREF#8.98
GPS_1PPS: length 13
  Top Layer w0.154: v1(5.97,21.84) 5.25,21.12 U5.4 ; U1.28 12.58,20.31 10.67,22.22 10.67,22.35
  Bottom Layer w0.154: v1(10.67,22.25) 10.26,21.84 v1(5.97,21.84)
GPS_3V3: length 13.5
  Top Layer w0.15: C22.2 16,25.69 v1(15.88,25.57)
  Top Layer w0.5: v1(9.91,25.44) 9.65,25.18 U5.8
  Top Layer w1: 9.91,25.97 v1(9.91,25.44) ; 15.88,25.25 v1(15.88,24.72)
  Bottom Layer w0.4: v1(15.88,24.72) 15.15,25.44 v1(9.91,25.44)
  vias: v1(9.91,26.29)
GPS_ANT: length 2.6
  Top Layer w0.154: U5.11 9.65,30.09 NOREF#35.4
GPS_ON: length 3
  Top Layer w0.15: 25.22,16.96 25.04,16.77 23.36,16.77 23.17,16.96 U1.8
GPS_VCC_ON_N: length 9.5
  Top Layer w0.154: 12.7,28.14 12.7,26.23 Q2.1 13.84,25.07 13.84,24.38 14.1,24.13 14.1,23.37 16.19,21.28 16.21,21.28 16.6,20.89 U1.27
I2C0_SCL: length 2.3
  Top Layer w0.15: 22.58,21.21 21.31,21.21 21,20.9 U1.16
  vias: v1(22.86,21.21)
I2C0_SDA: length 0.9
  Top Layer w0.15: v1(22.1,20.7) 21.71,20.31 U1.15
I2C1_SCL: length 1.8
  Top Layer w0.154: U1.5 23.18,15.76 23.45,15.49 NOREF#38.41
I2C1_SDA: length 1.7
  Top Layer w0.154: NOREF#19.57 23.12,15.36 U1.4
LED: length 20.6
  Top Layer w0.154: 15.25,16.16 15.21,16.13 14.6,16.13 v1(14.22,16.51) ; v1(25.78,20.57) 27.13,20.57 R18.2
  Bottom Layer w0.154: v1(25.78,20.57) 23.9,22.45 15.08,22.45 14.6,21.97 14.6,16.89 v1(14.22,16.51)
NRESET: length 14.8
  Top Layer w0.154: v1(15.49,23.75) 15.37,23.75 15.37,22.73 17,21.1 U1.26 ; v1(22.31,27.37) 23.91,27.37 U10.2
  Bottom Layer w0.154: v1(15.49,23.75) 18.67,23.75 19.81,24.89 20.32,24.89 22.1,26.67 22.1,27.16 v1(22.31,27.37)
QSPI_SCLK: length 7.9
  Top Layer w0.15: U1.52 19.8,12.21 20.78,11.22 20.78,7.57 21.24,7.11 21.84,7.11 21.97,7.24 U2.6
QSPI_SD0: length 6.1
  Top Layer w0.15: U1.53 20.2,12.32 21.08,11.43 21.08,8.38 21.47,7.99 U2.5
QSPI_SD1: length 3.2
  Top Layer w0.15: U2.2 22.48,10.66 22.48,11.05 21,12.53 U1.55
QSPI_SD2: length 3.1
  Top Layer w0.15: U1.54 20.6,12.42 21.97,11.05 21.97,10.66 U2.3
QSPI_SD3: length 9.1
  Top Layer w0.15: U2.7 22.48,7.63 22.48,7.24 22.05,6.81 21.01,6.81 20.45,7.37 20.45,11.05 19.4,12.1 U1.51
QSPI_SS: length 12.9
  Top Layer w0.15: U1.56 21.4,12.64 22.99,11.05 22.99,10.66 U2.1
  Top Layer w0.154: 22.99,10.66 23.62,10.66 v1(23.88,10.92) ; 28.07,10.36 v1(28.07,9.02)
  Top Layer w0.254: R16.1 24.97,10.92 v1(23.88,10.92) 23.5,10.92 23.25,10.66
  Bottom Layer w0.15: v1(23.88,10.92) 25.78,9.02 v1(28.07,9.02)
UART1_RX: length 31.3
  Top Layer w0.15: U1.12 23.35,18.56 v1(23.63,18.84)
  Top Layer w0.154: v1(25.53,22.35) 25.53,21.84 v1(24.38,20.7) ; v1(5.72,23.11) 4.44,23.11 3.05,21.72 U5.2
  Bottom Layer w0.154: v1(25.53,22.35) 25.12,22.76 14.71,22.76 13.21,24.26 6.73,24.26 5.72,23.24 v1(5.72,23.11) ; v1(23.63,18.84) 23.9,19.11 23.9,20.22 v1(24.38,20.7)
UART1_TX: length 2.1
  Top Layer w0.15: v1(24.26,18.54) 23.99,18.28 23.64,18.28 23.52,18.16 22.35,18.16
USB_DM: length 6.9
  Top Layer w0.154: 14.21,4.14 14.21,5.03 14.73,5.56 14.73,6.86 NOREF#37.79 15.75,7.87 15.75,9.47 R7.2
USB_DP: length 7.1
  Top Layer w0.154: R6.2 16.64,9.22 NOREF#31.75 16.64,6.73 14.86,4.95 14.86,4.14
VFO_VDD_ON_N: length 4.5
  Top Layer w0.15: NOREF#9.47 26.71,16.09 22.42,16.09 22.35,16.16
XIN: length 7.5
  Top Layer w0.15: U1.20 19.4,21.43 19.81,21.84 22.1,21.84 23.84,23.58 C5.2
XOUT: length 4.2
  Top Layer w0.15: U1.21 19,21.92 19.3,22.22 19.3,22.61 19.43,22.73 19.43,23.24 19.94,23.75 R1.2
$1N22007: length 2.7
  Top Layer w0.2: R7.1 16.38,11.05 17.4,12.06 U1.46
$1N22362: length 2.4
  Top Layer w0.2: R6.1 17.53,11.68 17.8,11.95 U1.47
$1N70752: length 2.9
  Top Layer w0.154: X2.3 21.06,24.94 19.94,24.94 19.94,26.12 19.81,26.25
$1N107124: length 3
  Top Layer w0.154: LED1.1 27.31,24.04 R18.1
$1N115739: length 7.7
  Top Layer w0.154: R10.1 21.81,28.57 21.91,28.47 ; 21.91,28.47 C35.2 ; 21.91,28.47 25.47,28.47 25.62,28.32 26.38,28.32 U10.3

## Copper pours and planes (outline as drawn; the poured copper is in the pictures)
1V1 on Top Layer: 16.89,18.95 20.99,18.95 20.99,13.92 16.89,13.92
3V3 on Top Layer: 15.96,19.61 21.63,19.61 21.63,13.92 15.96,13.92
3V3 on Top Layer: 21.67,13.97 26.8,13.97 26.8,10.16 21.67,10.16
3V3 on Top Layer: 11.94,13.9 15.65,13.9 15.65,12.95 11.94,12.95
3V3 on Bottom Layer: 11.94,22.99 13.72,22.99 13.72,13.21 11.94,13.21
3V3 on Bottom Layer: 13.69,15.22 16.7,15.22 16.7,13.22 13.69,13.22
GND on Top Layer: -1.4,53.47 30.51,53.47 30.51,-2.2 -1.4,-2.2
GND on Bottom Layer: -1.02,42.16 30.35,42.16 30.35,-2.03 -1.02,-2.03

Small or netless copper shapes (teardrops, artwork), in the pictures only: 2 on Top Layer

## Text on the board
Bottom Silkscreen Layer: GPIO 7 | 5 | I2C1 SCL | I2C1 SDA | 4 | GPIO 6 | GND | ADC0 | GPIO21 | BOOTSEL | POWER | RF1 | RF2 | +Vdc | - | GROUND | + | GPS | USB | D+ D- | 3V3 | KC3LBR / RP2040 / pico-WSPRer / gen2 v0.2
Top Silkscreen Layer: JLCJLCJLCJLC | KC3LBR | pico-WSPRer | Gen2 / v0.2 | remove / before / flight | BOOTSEL | 3V3 | +Vdc | RF1 | RF2 | gnd | GPS
